# Altium schematic sheet Morpheus_conector.SchDoc
size A4
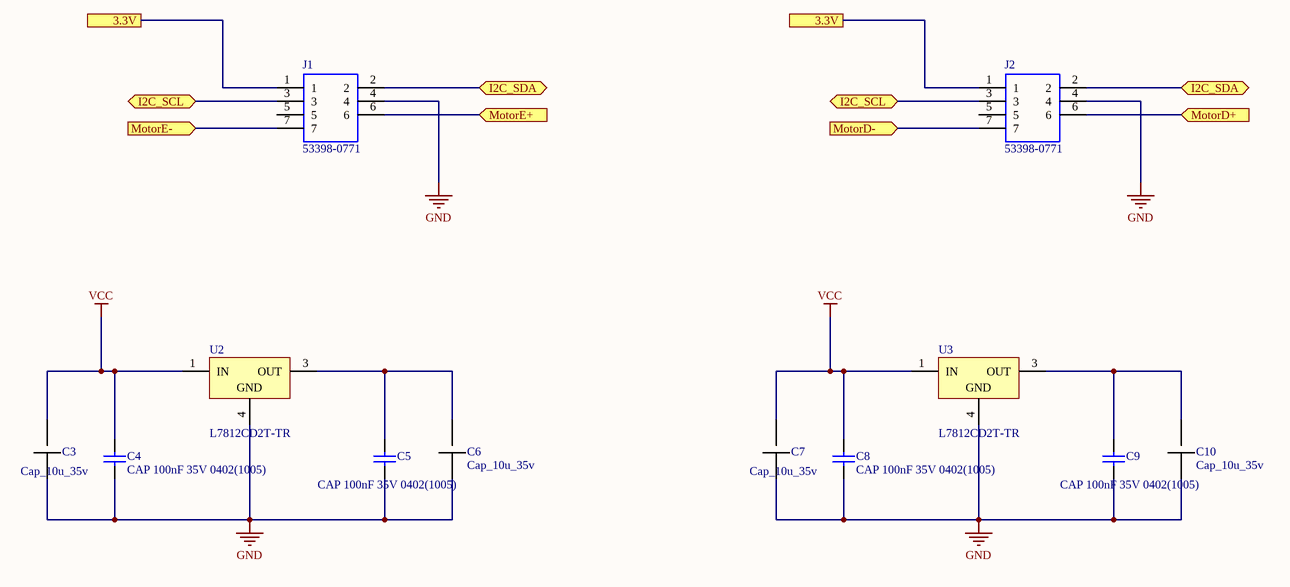
[diagram p0: Morpheus_conector.SchDoc]

## Parts
C3  Cap_10u_35v  [CAP POL 2917/7343]
C4  CAP 100nF 35V 0402(1005)  [CAPC0402(1005)60_N]
C5  CAP 100nF 35V 0402(1005)  [CAPC0402(1005)60_N]
C6  Cap_10u_35v  [CAP POL 2917/7343]
C7  Cap_10u_35v  [CAP POL 2917/7343]
C8  CAP 100nF 35V 0402(1005)  [CAPC0402(1005)60_N]
C9  CAP 100nF 35V 0402(1005)  [CAPC0402(1005)60_N]
C10  Cap_10u_35v  [CAP POL 2917/7343]
J1  53398-0771  [53398-0771]
J2  53398-0771  [53398-0771]
U2  L7812CD2T-TR  [TO-263_N]
U3  L7812CD2T-TR  [TO-263_N]

## Ports
3.3V, I2C_SCL (bidir), I2C_SDA (bidir), MotorD+ (in), MotorD- (in), MotorE+ (in), MotorE- (in)

## Nets
GND: C3.1 C4.1 C5.1 C6.1 C7.1 C8.1 C9.1 C10.1 J1.4 J2.4 U2.4(GND) U3.4(GND)
VCC: C3.2 C4.2 C7.2 C8.2 U2.1(IN) U3.1(IN)
3.3V: J1.1 J2.1 ; port 3.3V
I2C_SCL: J1.3 J2.3 ; port I2C_SCL
I2C_SDA: J1.2 J2.2 ; port I2C_SDA
MotorD+: J2.6 ; port MotorD+
MotorD-: J2.7 ; port MotorD-
MotorE+: J1.6 ; port MotorE+
MotorE-: J1.7 ; port MotorE-
NetC5_2: C5.2 C6.2 U2.3(OUT)
NetC9_2: C9.2 C10.2 U3.3(OUT)

Not connected (* = marked no-connect by the designer): J1 5; J2 5

## Library data of the parts
C3 C6 C7 C10 = Cap_10u_35v: 80-T491D106M35AT7280
C4 C5 C9 = CMP-1034-02076-1: CAP 100nF 35V ±20% 0402 (1005 Metric) Thickness 0.6mm SMD                                                 963-GMK105BJ104MV-F; Case-Metric: 1005; Tolerance: Â±20%; Case-EIA: 0402; Rated Voltage: 35 V; Max Thickness: 0.6 mm; Value: 100nF; Technology: SMT
C8 = CMP-1034-02076-1: CAP 100nF 35V ±20% 0402 (1005 Metric) Thickness 0.6mm SMD                                        963-GMK105BJ104MV-F; Case-Metric: 1005; Tolerance: Â±20%; Case-EIA: 0402; Rated Voltage: 35 V; Max Thickness: 0.6 mm; Value: 100nF; Technology: SMT
J1 J2 = 53398-0771: 7 way SMT straight header Molex PICOBLADE Series, Series Number 53398, 1.25mm Pitch 7 Way 1 Row Straight PCB Header, Solder Termination, 1A; Allied_Number: 70373150; Manufacturer_Name: Molex; Manufacturer_Part_Number: 53398-0771; RS Part Number: 5427220P; RS Price/Stock: http://uk.rs-online.com/web/p/products/5427220P; Allied Price/Stock: http://www.alliedelec.com/molex-incorporated-53398-0771/70373150/; Arrow Part Number: 53398-0771; Arrow Price/Stock: http://uk.rs-online.com/web/p/products/5427220P; Datasheet Link: http://www.molex.com/webdocs/datasheets/pdf/en-us/0533980771_PCB_HEADERS.pdf
U2 U3 = CMP-0244-00182-1: Positive Voltage Regulator, 3-Pin D2PAK, Tape and Reel; PackageDescription: 3-Pin Transistor Outline Package 2.54 mm Pitch, 15.4 mm Lead Span (D2PAK); ComponentLink1Description: Manufacturer URL; PackageReference: TO-263; DatasheetVersion: 16/11/2011; ComponentLink2URL: http://www.st.com/internet/com/TECHNICAL_RESOURCES/TECHNICAL_LITERATURE/DATASHEET/CD00000444.pdf; ComponentLink1URL: http://www.st.com; PackageVersion: 2011; ComponentLink2Description: Datasheet